# EAGLE design sensors (EAGLE 9.2.2)
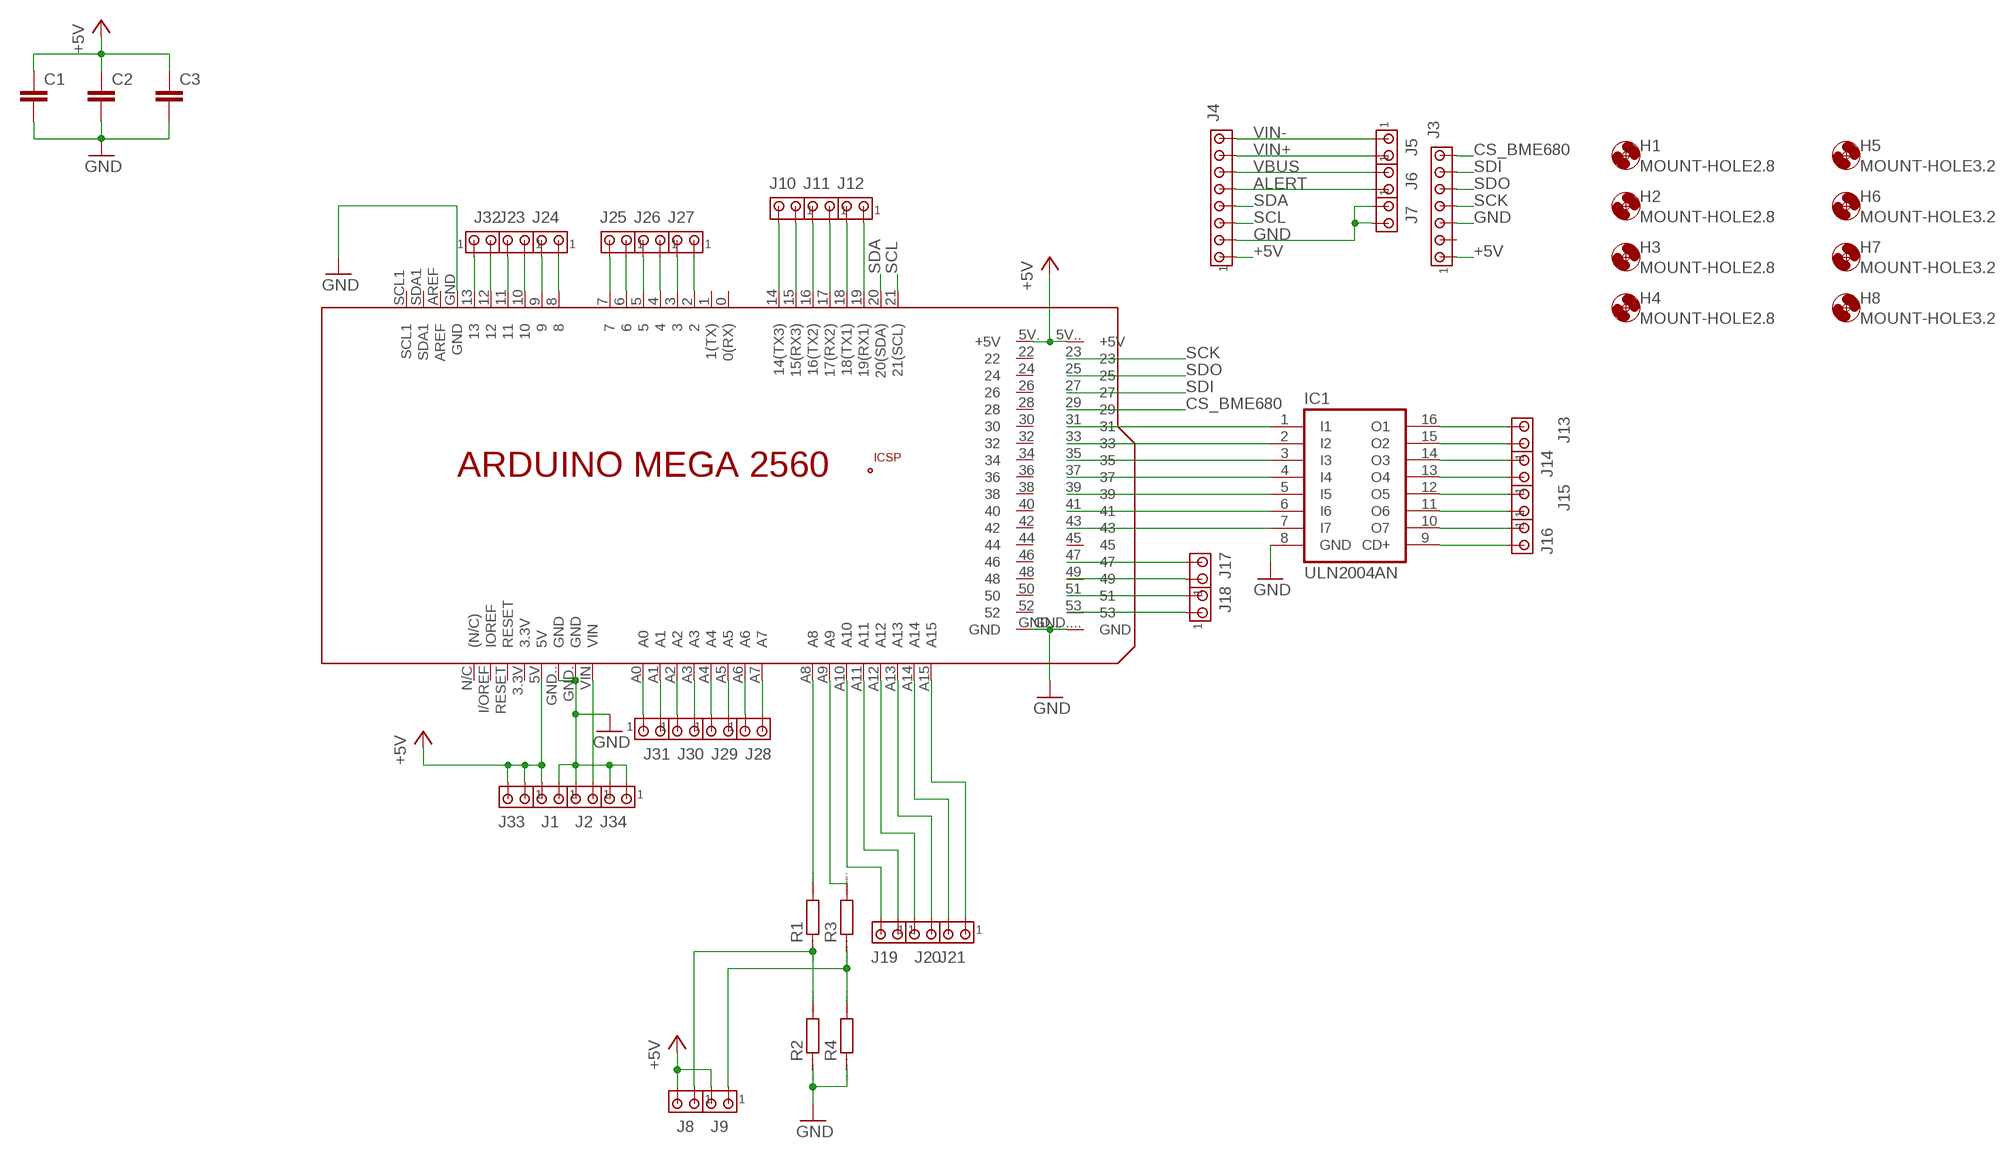
[diagram p0: schematic, sheet 1]

## Parts
C1  C2,5-3  [C2.5-3]
C2  C2,5-3  [C2.5-3]
C3  C2,5-3  [C2.5-3]
H1  MOUNT-HOLE2.8  [2,8]
H2  MOUNT-HOLE2.8  [2,8]
H3  MOUNT-HOLE2.8  [2,8]
H4  MOUNT-HOLE2.8  [2,8]
H5  MOUNT-HOLE3.2  [3,2]
H6  MOUNT-HOLE3.2  [3,2]
H7  MOUNT-HOLE3.2  [3,2]
H8  MOUNT-HOLE3.2  [3,2]
IC1  ULN2004AN  [DIL16]
J1  SCREW-2  [SCREW-2]
J2  SCREW-2  [SCREW-2]
J3  MTA07-100  [10X07MTA]
J4  MTA08-100  [10X08MTA]
J5  SCREW-2  [SCREW-2]
J6  SCREW-2  [SCREW-2]
J7  SCREW-2  [SCREW-2]
J8  SCREW-2  [SCREW-2]
J9  SCREW-2  [SCREW-2]
J10  SCREW-2  [SCREW-2]
J11  SCREW-2  [SCREW-2]
J12  SCREW-2  [SCREW-2]
J13  SCREW-2  [SCREW-2]
J14  SCREW-2  [SCREW-2]
J15  SCREW-2  [SCREW-2]
J16  SCREW-2  [SCREW-2]
J17  SCREW-2  [SCREW-2]
J18  SCREW-2  [SCREW-2]
J19  SCREW-2  [SCREW-2]
J20  SCREW-2  [SCREW-2]
J21  SCREW-2  [SCREW-2]
J23  SCREW-2  [SCREW-2]
J24  SCREW-2  [SCREW-2]
J25  SCREW-2  [SCREW-2]
J26  SCREW-2  [SCREW-2]
J27  SCREW-2  [SCREW-2]
J28  SCREW-2  [SCREW-2]
J29  SCREW-2  [SCREW-2]
J30  SCREW-2  [SCREW-2]
J31  SCREW-2  [SCREW-2]
J32  SCREW-2  [SCREW-2]
J33  SCREW-2  [SCREW-2]
J34  SCREW-2  [SCREW-2]
PCB1  ARDUINO_MEGA2560_NEW  [ARDUINO_MEGA2560]
R1  R0207/10  [0207/10]
R2  R0207/10  [0207/10]
R3  R0207/10  [0207/10]
R4  R0207/10  [0207/10]

## Nets
+5V: C1.1 C2.1 C3.1 J1.2 J3.1 J4.1 J8.2 J9.2 J33.1 J33.2 PCB1.5V PCB1.5V.(+5V) PCB1.5V..(+5V)
ALERT: J4.5 J6.2
CS_BME680: J3.7 PCB1.29
GND: C1.2 C2.2 C3.2 IC1.8(GND) J1.1 J2.2 J3.3 J4.2 J7.1 J7.2 J34.1 J34.2 PCB1.GND PCB1.GND.(GND) PCB1.GND..(GND) PCB1.GND...(GND) PCB1.GND....(GND) R2.1 R4.1
N$1: J2.1 PCB1.VIN
N$2: PCB1.A8 R1.2
N$3: J8.1 R1.1 R2.2
N$4: PCB1.A9 R3.2
N$5: J9.1 R3.1 R4.2
N$6: J19.2 PCB1.A10
N$7: J19.1 PCB1.A11
N$8: J20.1 PCB1.A12
N$9: J20.2 PCB1.A13
N$10: J21.2 PCB1.A14
N$11: J21.1 PCB1.A15
N$12: IC1.1(I1) PCB1.31
N$13: IC1.2(I2) PCB1.33
N$14: IC1.3(I3) PCB1.35
N$15: IC1.4(I4) PCB1.37
N$16: IC1.5(I5) PCB1.39
N$17: IC1.6(I6) PCB1.41
N$18: IC1.7(I7) PCB1.43
N$19: IC1.16(O1) J13.2
N$20: IC1.15(O2) J13.1
N$21: IC1.14(O3) J14.2
N$22: IC1.13(O4) J14.1
N$23: IC1.12(O5) J15.2
N$24: IC1.11(O6) J15.1
N$25: IC1.10(O7) J16.1
N$26: IC1.9(CD+) J16.2
N$27: J10.2 PCB1.14(14(TX3))
N$28: J10.1 PCB1.15(15(RX3))
N$29: J11.2 PCB1.16(16(TX2))
N$30: J11.1 PCB1.17(17(RX2))
N$31: J12.2 PCB1.18(18(TX1))
N$32: J12.1 PCB1.19(19(RX1))
N$33: J32.1 PCB1.13
N$34: J32.2 PCB1.12
N$35: J23.2 PCB1.11
N$36: J23.1 PCB1.10
N$37: J24.2 PCB1.9
N$38: J24.1 PCB1.8
N$39: J25.2 PCB1.7
N$40: J25.1 PCB1.6
N$41: J26.2 PCB1.5
N$42: J26.1 PCB1.4
N$43: J27.2 PCB1.3
N$44: J27.1 PCB1.2
N$47: J18.1 PCB1.53
N$48: J18.2 PCB1.51
N$49: J17.1 PCB1.49
N$50: J17.2 PCB1.47
N$51: J31.1 PCB1.A0
N$52: J31.2 PCB1.A1
N$53: J30.1 PCB1.A2
N$54: J30.2 PCB1.A3
N$55: J29.1 PCB1.A4
N$56: J29.2 PCB1.A5
N$57: J28.1 PCB1.A6
N$58: J28.2 PCB1.A7
SCK: J3.4 PCB1.23
SCL: J4.3 PCB1.21(21(SCL))
SDA: J4.4 PCB1.20(20(SDA))
SDI: J3.6 PCB1.27
SDO: J3.5 PCB1.25
VBUS: J4.6 J6.1
VIN+: J4.7 J5.2
VIN-: J4.8 J5.1
Unconnected: J3.2 PCB1.0(0(RX)) PCB1.1(1(TX)) PCB1.3.3V PCB1.22 PCB1.24 PCB1.26 PCB1.28 PCB1.30 PCB1.32 PCB1.34 PCB1.36 PCB1.38 PCB1.40 PCB1.42 PCB1.44 PCB1.45 PCB1.46 PCB1.48 PCB1.50 PCB1.52 PCB1.+5V_ PCB1.AREF PCB1.GND__ PCB1.I/OREF(IOREF) PCB1.MISO PCB1.MOSI PCB1.N/C((N/C)) PCB1.RESET PCB1.RESET. PCB1.SCK PCB1.SCL1 PCB1.SDA1

## Library data of the parts
C1-C3 = capacitor-wima:C: CAPACITOR naming: grid - package width
H1-H8 = Jelbert:MOUNT-HOLE: MOUNTING HOLE with drill center marker
IC1 = uln-udn:ULN2004A: DRIVER ARRAY
J1 J2 J5-J21 J23-J34 = Jelbert:SCREW-2: 2 Pin screw terminal
J3 = con-amp:MTA07-100: AMP connector
J4 = con-amp:MTA08-100: AMP connector
PCB1 = E14_Arduino_revC:ARDUINO_MEGA2560_NEW: Device for representing an Arduino Mega 2560 board with a footprint in an EAGLE design. Created by Dave Young for Element14. More EAGLE documentation at: http://www.element14.com/community/community/knode/cadsoft_eagle
R1-R4 = eagle-ltspice:R: RESISTOR, European symbol; SPICEMODEL: NONE; SPICEPREFIX: R

## Board
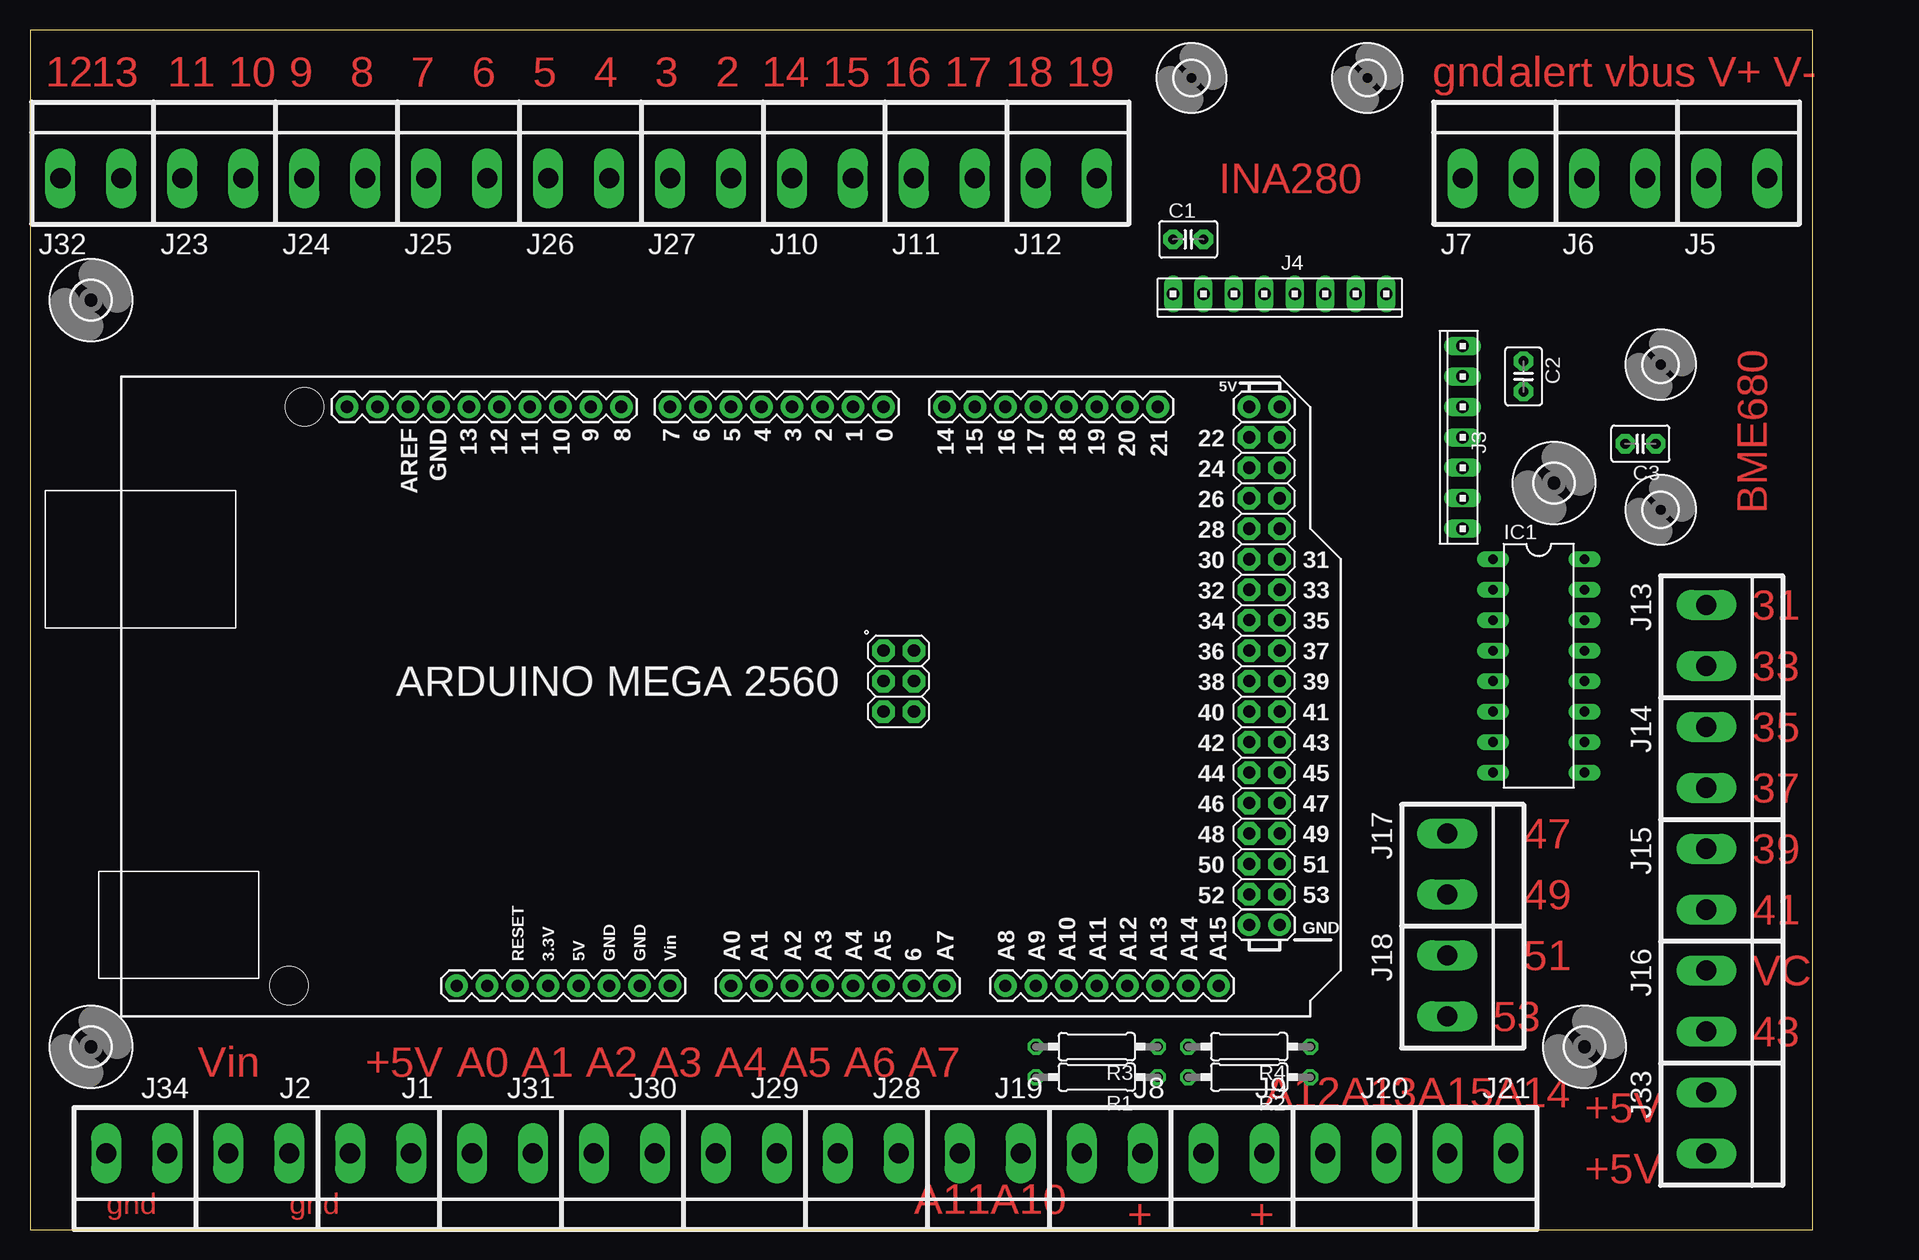
[diagram p1: board, top side]
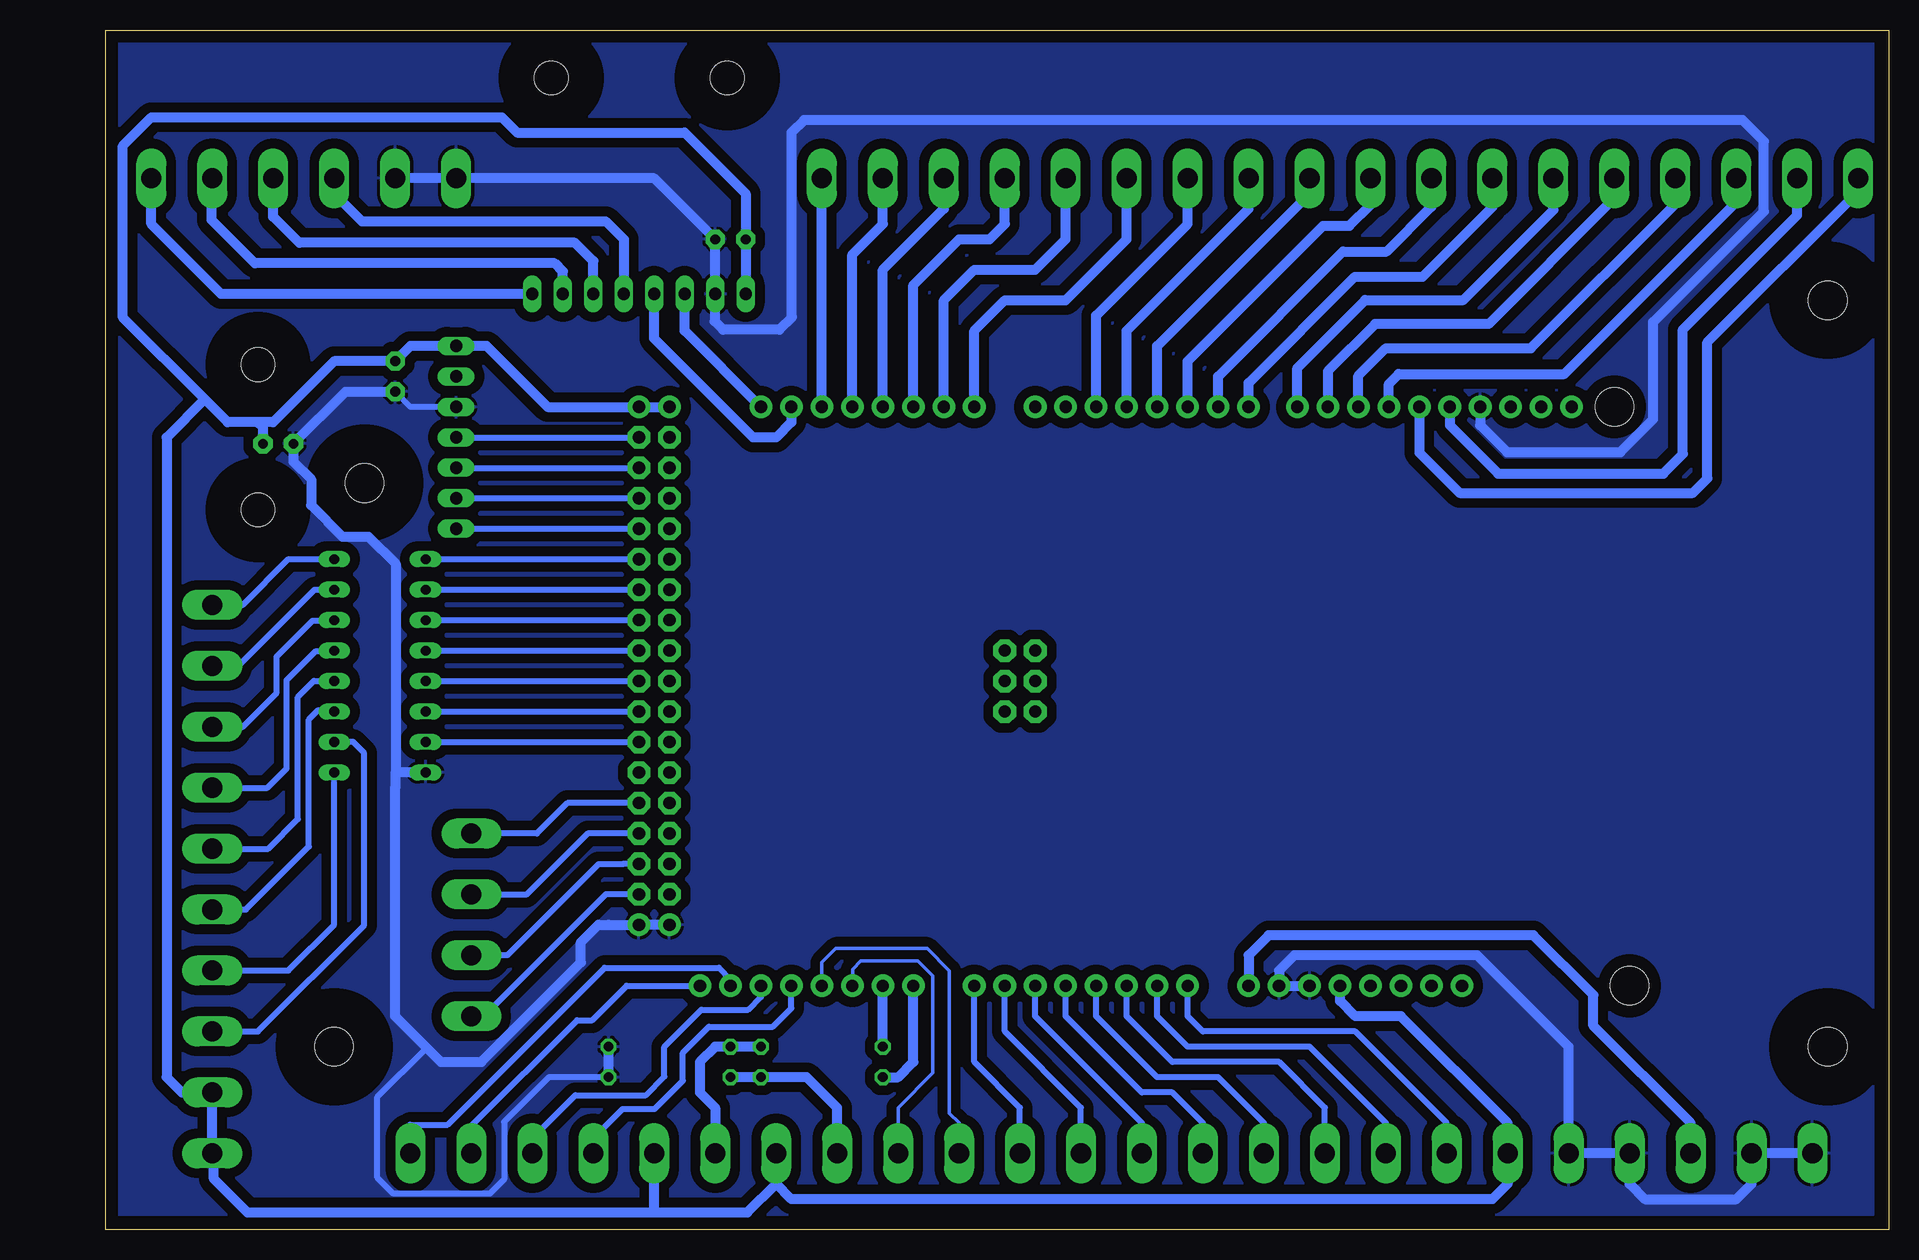
[diagram p2: board, bottom side, seen from below]

Size 148.57 x 100 mm. Coordinates in mm from the lower left corner, seen from the top.
Outline: 0,0 148.57,0 148.57,100 0,100 0,0
Copper layers (1*16): Top 0.035mm / dielectric 1.5mm / Bottom 0.035mm
Design rules "default *": minimum track width 6mil, minimum drill 0.35mm, track to track 0.2mm, track to pad 0.2mm, pad to pad 0.2mm, via to via 0.2mm, smd to smd 6mil, copper to edge 40mil, drill to drill 6mil, minimum pad ring 10mil, minimum via ring 8mil, stop-mask expansion 4mil, vias tented up to drill 0mil, thermal gap 10mil

### Footprints (pad centres in the part's own frame; a part is rotated, then mirrored left to right if it is on the bottom)
C2.5-3 = drill 0.813 pad 1.6 octagon: 1 -1.27,0; 2 1.27,0
2,8 = hole 2.8: 0,0
3,2 = hole 3.2: 0,0
DIL16 = drill 0.813 long: 1 -8.89,-3.81; 2 -6.35,-3.81; 3 -3.81,-3.81; 4 -1.27,-3.81; 5 1.27,-3.81; 6 3.81,-3.81; 7 6.35,-3.81; 8 8.89,-3.81; 9 8.89,3.81; 10 6.35,3.81; 11 3.81,3.81; 12 1.27,3.81; 13 -1.27,3.81; 14 -3.81,3.81; 15 -6.35,3.81; 16 -8.89,3.81
SCREW-2 = drill 1.676 long: 1 2.54,0; 2 -2.54,0
10X07MTA = drill 1.016 long: 1 7.62,0; 2 5.08,0; 3 2.54,0; 4 0,0; 5 -2.54,0; 6 -5.08,0; 7 -7.62,0
10X08MTA = drill 1.016 long: 1 8.89,0; 2 6.35,0; 3 3.81,0; 4 1.27,0; 5 -1.27,0; 6 -3.81,0; 7 -6.35,0; 8 -8.89,0
ARDUINO_MEGA2560 = drill 1.016 pad 1.88: 0 63.5,50.8; 1 60.96,50.8; 2 58.42,50.8; 3 55.88,50.8; 3.3V 35.56,2.54; 4 53.34,50.8; 5 50.8,50.8; 5V 38.1,2.54; 5V. 93.98,50.8; 5V.. 96.52,50.8; 6 48.26,50.8; 7 45.72,50.8; 8 41.656,50.8; 9 39.116,50.8; 10 36.576,50.8; 11 34.036,50.8; 12 31.496,50.8; 13 28.956,50.8; 14 68.58,50.8; 15 71.12,50.8; 16 73.66,50.8; 17 76.2,50.8; 18 78.74,50.8; 19 81.28,50.8; 20 83.82,50.8; 21 86.36,50.8; A0 50.8,2.54; A1 53.34,2.54; A2 55.88,2.54; A3 58.42,2.54; A4 60.96,2.54; A5 63.5,2.54; A6 66.04,2.54; A7 68.58,2.54; A8 73.66,2.54; A9 76.2,2.54; A10 78.74,2.54; A11 81.28,2.54; A12 83.82,2.54; A13 86.36,2.54; A14 88.9,2.54; A15 91.44,2.54; AREF 23.876,50.8; GND 26.416,50.8; GND. 43.18,2.54; GND.. 40.64,2.54; GND... 93.98,7.62; GND.... 96.52,7.62; I/OREF 30.48,2.54; N/C 27.94,2.54; RESET 33.02,2.54; SCL1 18.796,50.8; SDA1 21.336,50.8; VIN 45.72,2.54 | drill 1.016 pad 1.88 octagon: 22 93.98,48.26; 23 96.52,48.26; 24 93.98,45.72; 25 96.52,45.72; 26 93.98,43.18; 27 96.52,43.18; 28 93.98,40.64; 29 96.52,40.64; 30 93.98,38.1; 31 96.52,38.1; 32 93.98,35.56; 33 96.52,35.56; 34 93.98,33.02; 35 96.52,33.02; 36 93.98,30.48; 37 96.52,30.48; 38 93.98,27.94; 39 96.52,27.94; 40 93.98,25.4; 41 96.52,25.4; 42 93.98,22.86; 43 96.52,22.86; 44 93.98,20.32; 45 96.52,20.32; 46 93.98,17.78; 47 96.52,17.78; 48 93.98,15.24; 49 96.52,15.24; 50 93.98,12.7; 51 96.52,12.7; 52 93.98,10.16; 53 96.52,10.16; +5V_ 66.04,30.48; GND__ 66.04,25.4; MISO 63.5,30.48; MOSI 66.04,27.94; RESET. 63.5,25.4; SCK 63.5,27.94 | hole 3.2: 15.24,50.8; 13.97,2.54
0207/10 = drill 0.813 octagon: 1 -5.08,0; 2 5.08,0

### Placement (x,y rotation side)
C1  96.52,82.55 0 top
C2  124.46,71.12 270 top
C3  134.2,65.51 180 top
H1  96.79,96 0 top
H2  111.45,96 0 top
H3  135.89,72.1 0 top
H4  135.89,60 0 top
H5  5.08,15.24 0 top
H6  5.08,77.47 0 top
H7  129.54,15.24 0 top
H8  127,62.23 0 top
IC1  125.73,46.99 270 top
J1  29.21,6.35 180 top
J2  19.05,6.35 180 top
J3  119.38,66.04 90 top
J4  104.14,78 180 top
J5  142.24,87.63 0 top
J6  132.08,87.63 0 top
J7  121.92,87.63 0 top
J8  90.17,6.35 180 top
J9  100.33,6.35 180 top
J10  66.04,87.63 0 top
J11  76.2,87.63 0 top
J12  86.36,87.63 0 top
J13  139.7,49.53 270 top
J14  139.7,39.37 270 top
J15  139.7,29.21 270 top
J16  139.7,19.05 270 top
J17  118.11,30.48 270 top
J18  118.11,20.32 270 top
J19  80.01,6.35 180 top
J20  110.49,6.35 180 top
J21  120.65,6.35 180 top
J23  15.24,87.63 0 top
J24  25.4,87.63 0 top
J25  35.56,87.63 0 top
J26  45.72,87.63 0 top
J27  55.88,87.63 0 top
J28  69.85,6.35 180 top
J29  59.69,6.35 180 top
J30  49.53,6.35 180 top
J31  39.37,6.35 180 top
J32  5.08,87.63 0 top
J33  139.7,8.89 270 top
J34  8.89,6.35 180 top
PCB1  7.62,17.78 0 top
R1  88.9,12.7 180 top
R2  101.6,12.7 180 top
R3  88.9,15.24 180 top
R4  101.6,15.24 180 top

### Tracks (layer width: path | path; a pad name or v marks a point on that pad's centre or on a via)
+5V
  Bottom 0.813: PCB1.5V 45.72,19.05 44.45,17.78 40.64,17.78 31.75,8.89 J1.2 31.75,3.81 33.02,2.54 91.44,2.54 92.71,3.81 | J8.2 92.71,3.81 | 135.89,67.31 134.62,67.31 129.54,72.39 C2.1 123.19,73.66 J3.1 116.84,73.66 111.76,68.58 PCB1.5V.. PCB1.5V. | 135.89,67.31 138.43,67.31 140.34,69.22 | 140.34,69.22 147.15,76.03 147.15,90.34 144.78,92.71 115.57,92.71 114.3,91.44 100.33,91.44 95.25,86.36 C1.1 J4.1 | C3.1 135.47,66.89 135.89,67.31 | 140.34,69.22 143.51,66.04 143.51,12.7 142.24,11.43 J33.2 J33.1 139.56,6.21 139.56,4.22 136.77,1.42 102.87,1.42 | 102.87,1.42 95.1,1.42 92.71,3.81 | 102.87,1.42 J9.2
ALERT
  Bottom 0.813: J6.2 129.54,86.36 127.24,84.06 106.92,84.06 105.41,82.55 J4.5
CS_BME680
  Bottom 0.508: J3.7 PCB1.29
GND
  Bottom 0.508: J3.3 123.19,68.58 C2.2 | R2.1 111.65,12.7 115.38,8.97 115.38,4.18 116.56,3 124.61,3 125.93,4.32 125.93,11.06 121.96,15.03 121.96,15.28
  Bottom 0.813: J34.1 J34.2 11.43,3.81 12.7,2.54 20.32,2.54 21.59,3.81 J2.2 J1.1 26.67,15.24 34.29,22.86 49.53,22.86 50.8,21.59 PCB1.GND. PCB1.GND.. | R2.1 R4.1 | J7.1 J7.2 102.87,87.63 C1.2 J4.2 97.79,75.77 97.84,75.72 97.13,75.01 92.44,75.01 91.38,76.07 91.44,76.14 91.44,91.44 90.39,92.49 12.18,92.49 10.4,90.72 10.4,84.87 19.62,75.65 19.62,67.54 22.36,64.81 31.8,64.81 34.04,67.04 PCB1.GND | PCB1.GND... PCB1.GND.... | 106.66,25.4 PCB1.GND.... | PCB1.GND.... 107.52,25.4 108.98,23.94 108.98,22.26 117.27,13.97 120.65,13.97 121.96,15.28 124.46,17.78 124.46,36.83 124.43,36.86 124.43,38.1 | 124.43,38.1 124.43,55.51 126.68,57.76 128.85,57.76 131.47,60.38 131.47,62.55 132.93,64.01 C3.2 128.59,69.85 C2.2 | 123.13,38.1 IC1.8 124.43,38.1
  pour Bottom (isolate 0.813): 1.27,1.27 1.27,99.06 34.29,99.06 148.08,99.06 148.08,63.07 148.08,1.27 3.81,1.27
N$1
  Bottom 0.813: J2.1 16.51,8.89 24.61,16.99 24.61,19.55 29.6,24.54 51.66,24.54 53.34,22.86 PCB1.VIN
N$2
  Bottom 0.813: R1.2 82.55,12.7 81.28,13.97 PCB1.A8
N$3
  Bottom 0.813: R2.2 R1.1 90.17,12.7 87.63,10.16 J8.1
N$4
  Bottom 0.813: R3.2 PCB1.A9
N$5
  Bottom 0.813: R3.1 R4.2 97.79,15.24 99.06,13.97 99.06,11.43 97.79,10.16 J9.1
N$6
  Bottom 0.305: J19.2 82.55,10.16 79.67,13.04 79.67,21.16 80.91,22.4 85.65,22.4 86.35,21.7 86.35,20.33 PCB1.A10
N$7
  Bottom 0.305: J19.1 77.47,8.89 78.27,9.69 78.27,21.57 80.14,23.43 87.73,23.43 88.9,22.26 PCB1.A11
N$8
  Bottom 0.508: J20.1 107.95,7.62 105.51,10.06 102.83,10.06 100.48,12.41 100.48,14.73 98.31,16.9 92.99,16.9 91.44,18.45 PCB1.A12
N$9
  Bottom 0.508: J20.2 113.03,7.62 109.45,11.2 103.57,11.2 102.02,12.75 102.02,15.24 98.93,18.33 95.05,18.33 93.98,19.39 PCB1.A13
N$10
  Bottom 0.508: J21.2 123.19,8.72 123.2,8.74 120.09,8.74 107.01,21.82 97.47,21.82 96.52,20.87 PCB1.A14
N$11
  Bottom 0.508: J21.1 118.11,8.64 109.3,17.45 108.03,17.45 105.16,20.32 PCB1.A15
N$12
  Bottom 0.508: IC1.1 PCB1.31
N$13
  Bottom 0.508: IC1.2 PCB1.33
N$14
  Bottom 0.508: IC1.3 PCB1.35
N$15
  Bottom 0.508: IC1.4 PCB1.37
N$16
  Bottom 0.508: IC1.5 PCB1.39
N$17
  Bottom 0.508: IC1.6 PCB1.41
N$18
  Bottom 0.508: IC1.7 PCB1.43
N$19
  Bottom 0.508: J13.2 137.16,52.07 133.35,55.88 IC1.16
N$20
  Bottom 0.508: J13.1 137.54,46.99 131.18,53.35 131.17,53.34 IC1.15
N$21
  Bottom 0.508: J14.2 137.16,41.91 134.34,44.73 134.34,47.75 131.33,50.76 129.58,50.76 IC1.14
N$22
  Bottom 0.508: IC1.13 129.58,48.22 131.08,48.22 133.5,45.8 133.5,38.43 135.1,36.83 J14.1
N$23
  Bottom 0.508: J15.2 135.05,31.75 132.57,34.23 132.57,44.39 131.23,45.73 131.22,45.72 IC1.12
N$24
  Bottom 0.508: J15.1 136.91,26.67 131.65,31.93 131.65,42.51 130.86,43.29 129.65,43.29 IC1.11
N$25
  Bottom 0.508: J16.1 135.89,16.51 127.04,25.36 127.04,39.73 127.97,40.65 129.53,40.65 IC1.10
N$26
  Bottom 0.508: J16.2 133.35,21.59 129.54,25.4 IC1.9
N$27
  Bottom 0.813: J10.2 63.5,82.55 68.58,77.47 73.66,77.47 76.2,74.93 PCB1.14
N$28
  Bottom 0.813: PCB1.15 78.74,77.47 76.2,80.01 71.12,80.01 68.58,82.55 J10.1
N$29
  Bottom 0.813: PCB1.16 81.28,78.74 77.47,82.55 74.93,82.55 73.66,83.82 J11.2
N$30
  Bottom 0.813: PCB1.17 83.82,80.01 78.74,85.09 J11.1
N$31
  Bottom 0.813: PCB1.18 86.36,81.28 83.82,83.82 J12.2
N$32
  Bottom 0.813: PCB1.19 J12.1
N$33
  Bottom 0.813: PCB1.13 36.58,67.06 32.54,63.02 18.78,63.02 17.14,64.66 17.14,75.03 7.62,84.56 J32.1
N$34
  Bottom 0.813: PCB1.12 39.12,64.76 35.76,61.4 16.32,61.4 15.1,62.62 15.1,73.98 2.54,86.54 J32.2
N$35
  Bottom 0.813: PCB1.11 41.66,70.5 40.83,71.32 27.03,71.32 12.7,85.65 J23.2
N$36
  Bottom 0.813: PCB1.10 44.2,71.18 41.91,73.47 29.81,73.47 17.78,85.5 J23.1
N$37
  Bottom 0.813: J24.2 23.08,87.41 23.08,85.75 33.34,75.49 42.8,75.49 46.74,71.55 PCB1.9
N$38
  Bottom 0.813: PCB1.8 49.28,71.83 43.62,77.48 35.45,77.48 27.94,84.99 J24.1
N$39
  Bottom 0.813: PCB1.7 53.34,70.57 44.49,79.43 38.84,79.43 33.02,85.24 J25.2
N$40
  Bottom 0.813: PCB1.6 55.88,71.12 45.48,81.52 41.83,81.52 38.1,85.25 J25.1
N$41
  Bottom 0.813: PCB1.5 58.42,72.39 47.13,83.68 44.93,83.68 43.18,85.43 J26.2
N$42
  Bottom 0.813: PCB1.4 60.96,73.66 48.26,86.36 J26.1
N$43
  Bottom 0.813: PCB1.3 63.5,74.93 53.34,85.09 J27.2
N$44
  Bottom 0.813: PCB1.2 66.04,76.2 58.42,83.82 J27.1
N$47
  Bottom 0.508: PCB1.53 106.9,27.94 117.06,17.78 J18.1
N$48
  Bottom 0.508: PCB1.51 105.44,30.48 105.47,30.44 107.52,30.44 115.1,22.86 J18.2
N$49
  Bottom 0.508: PCB1.49 108.42,33.02 113.54,27.9 118.07,27.9 J17.1
N$50
  Bottom 0.508: PCB1.47 110.11,35.56 112.65,33.02 J17.2
N$51
  Bottom 0.508: J31.1 36.83,8.89 44.45,16.51 57.15,16.51 58.42,17.78 PCB1.A0
N$52
  Bottom 0.508: J31.2 41.91,8.89 48.26,15.24 58.42,15.24 60.96,17.78 PCB1.A1
N$53
  Bottom 0.508: J30.1 46.99,10.16 50.8,13.97 59.69,13.97 63.5,17.78 PCB1.A2
N$54
  Bottom 0.508: J30.2 52.07,8.89 55.88,12.7 60.96,12.7 66.04,17.78 PCB1.A3
N$55
  Bottom 0.508: J29.1 57.15,8.89 59.69,11.43 62.23,11.43 68.58,17.78 PCB1.A4
N$56
  Bottom 0.508: J29.2 62.23,8.89 71.12,17.78 PCB1.A5
N$57
  Bottom 0.508: J28.1 67.31,10.16 73.66,16.51 PCB1.A6
N$58
  Bottom 0.508: J28.2 72.39,10.16 76.2,13.97 PCB1.A7
SCK
  Bottom 0.508: J3.4 PCB1.23
SCL
  Bottom 0.813: PCB1.21 100.33,74.93 J4.3
SDA
  Bottom 0.813: PCB1.20 91.44,67.31 92.71,66.04 94.63,66.04 102.87,74.28 J4.4
SDI
  Bottom 0.508: J3.6 PCB1.27
SDO
  Bottom 0.508: J3.5 PCB1.25
VBUS
  Bottom 0.813: J4.6 107.95,80.73 109.47,82.26 132.45,82.26 134.62,84.43 J6.1
VIN+
  Bottom 0.813: J4.7 110.49,79.86 111.18,80.54 136.14,80.54 139.76,84.16 139.76,87.57 J5.2
VIN-
  Bottom 0.813: J4.8 138.96,78 144.78,83.82 J5.1

### Text on the board
Top: 12 | 13 | 11 | 10 | 9 | 8 | 7 | 6 | 5 | 4 | 3 | 2 | 14 | 15 | 16 | 17 | 18 | 19 | gnd | alert vbus V+ V- | INA280 | BME680 | 31 | 33 | 35 | 37 | 47 | 39 | 49 | 41 | 51 | VC | 53 | 43 | Vin | +5V | A0 A1 A2 A3 A4 A5 A6 A7 | A12A13A15A14 | +5V | +5V | gnd | gnd | A11A10 | + | +